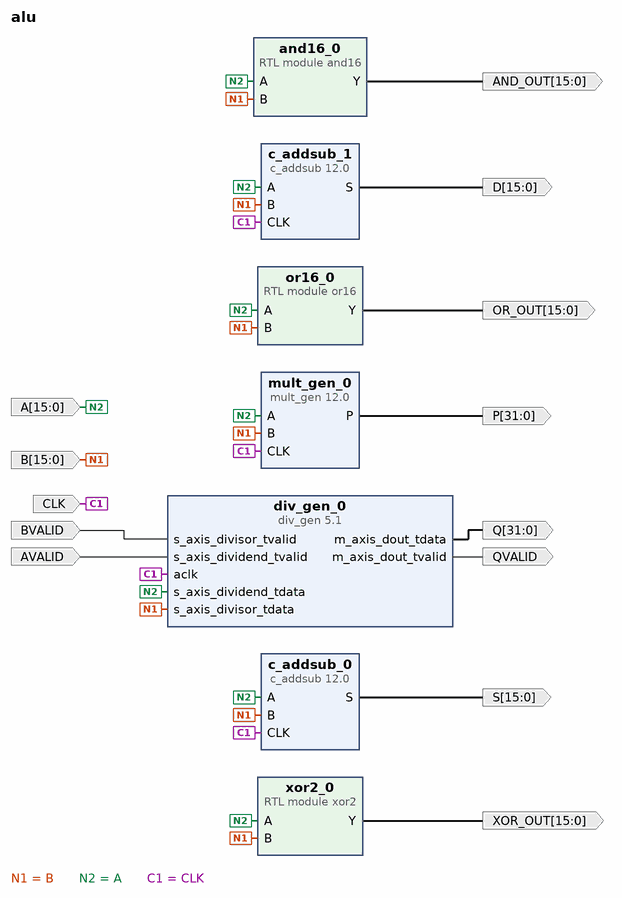
[diagram p0: block diagram of the top level]
# Vivado block design alu, xc7a100tcsg324-1, Vivado 2019.2
create_bd_design alu

create_bd_port -dir I -from 15 -to 0 B
create_bd_port -dir I BVALID
create_bd_port -dir I -from 15 -to 0 A
create_bd_port -dir I AVALID
create_bd_port -dir I CLK
create_bd_port -dir O -from 31 -to 0 Q
create_bd_port -dir O QVALID
create_bd_port -dir O -from 15 -to 0 S
create_bd_port -dir O -from 15 -to 0 D
create_bd_port -dir O -from 31 -to 0 P
create_bd_port -dir O -from 15 -to 0 AND_OUT
create_bd_port -dir O -from 15 -to 0 OR_OUT
create_bd_port -dir O -from 15 -to 0 XOR_OUT

create_bd_cell -type ip -vlnv xilinx.com:ip:div_gen:5.1 div_gen_0
create_bd_cell -type ip -vlnv xilinx.com:ip:mult_gen:12.0 mult_gen_0
set_property -dict {CONFIG.PipeStages 4 CONFIG.PortAWidth 16 CONFIG.PortBWidth 16} [get_bd_cells mult_gen_0]
create_bd_cell -type ip -vlnv xilinx.com:ip:c_addsub:12.0 c_addsub_0
set_property -dict [list \
  CONFIG.A_Width 16 \
  CONFIG.B_Value 0000000000000000 \
  CONFIG.B_Width 16 \
  CONFIG.CE false \
  CONFIG.Latency 1 \
  CONFIG.Out_Width 16 \
] [get_bd_cells c_addsub_0]
create_bd_cell -type ip -vlnv xilinx.com:ip:c_addsub:12.0 c_addsub_1
set_property -dict [list \
  CONFIG.A_Width 16 \
  CONFIG.Add_Mode Subtract \
  CONFIG.B_Value 0000000000000000 \
  CONFIG.B_Width 16 \
  CONFIG.CE false \
  CONFIG.Latency 1 \
  CONFIG.Out_Width 16 \
] [get_bd_cells c_addsub_1]
create_bd_cell -type module -reference and16 and16_0
create_bd_cell -type module -reference or16 or16_0
create_bd_cell -type module -reference xor2 xor2_0

# ---- connections ----

connect_bd_net [get_bd_ports B] \
  [get_bd_pins div_gen_0/s_axis_divisor_tdata] [get_bd_pins c_addsub_0/B] [get_bd_pins c_addsub_1/B] \
  [get_bd_pins mult_gen_0/B] [get_bd_pins and16_0/B] [get_bd_pins or16_0/B] [get_bd_pins xor2_0/B]
connect_bd_net [get_bd_ports BVALID] [get_bd_pins div_gen_0/s_axis_divisor_tvalid]
connect_bd_net [get_bd_ports A] \
  [get_bd_pins c_addsub_0/A] [get_bd_pins c_addsub_1/A] [get_bd_pins mult_gen_0/A] \
  [get_bd_pins div_gen_0/s_axis_dividend_tdata] [get_bd_pins and16_0/A] [get_bd_pins or16_0/A] [get_bd_pins xor2_0/A]
connect_bd_net [get_bd_ports AVALID] [get_bd_pins div_gen_0/s_axis_dividend_tvalid]
connect_bd_net [get_bd_ports CLK] [get_bd_pins c_addsub_0/CLK] [get_bd_pins c_addsub_1/CLK] [get_bd_pins div_gen_0/aclk] [get_bd_pins mult_gen_0/CLK]
connect_bd_net [get_bd_pins div_gen_0/m_axis_dout_tdata] [get_bd_ports Q]
connect_bd_net [get_bd_pins div_gen_0/m_axis_dout_tvalid] [get_bd_ports QVALID]
connect_bd_net [get_bd_pins c_addsub_0/S] [get_bd_ports S]
connect_bd_net [get_bd_pins c_addsub_1/S] [get_bd_ports D]
connect_bd_net [get_bd_pins mult_gen_0/P] [get_bd_ports P]
connect_bd_net [get_bd_pins and16_0/Y] [get_bd_ports AND_OUT]
connect_bd_net [get_bd_pins or16_0/Y] [get_bd_ports OR_OUT]
connect_bd_net [get_bd_pins xor2_0/Y] [get_bd_ports XOR_OUT]

validate_bd_design
save_bd_design
